# EAGLE design zOUT_v.1.0 (EAGLE 6.5.0)
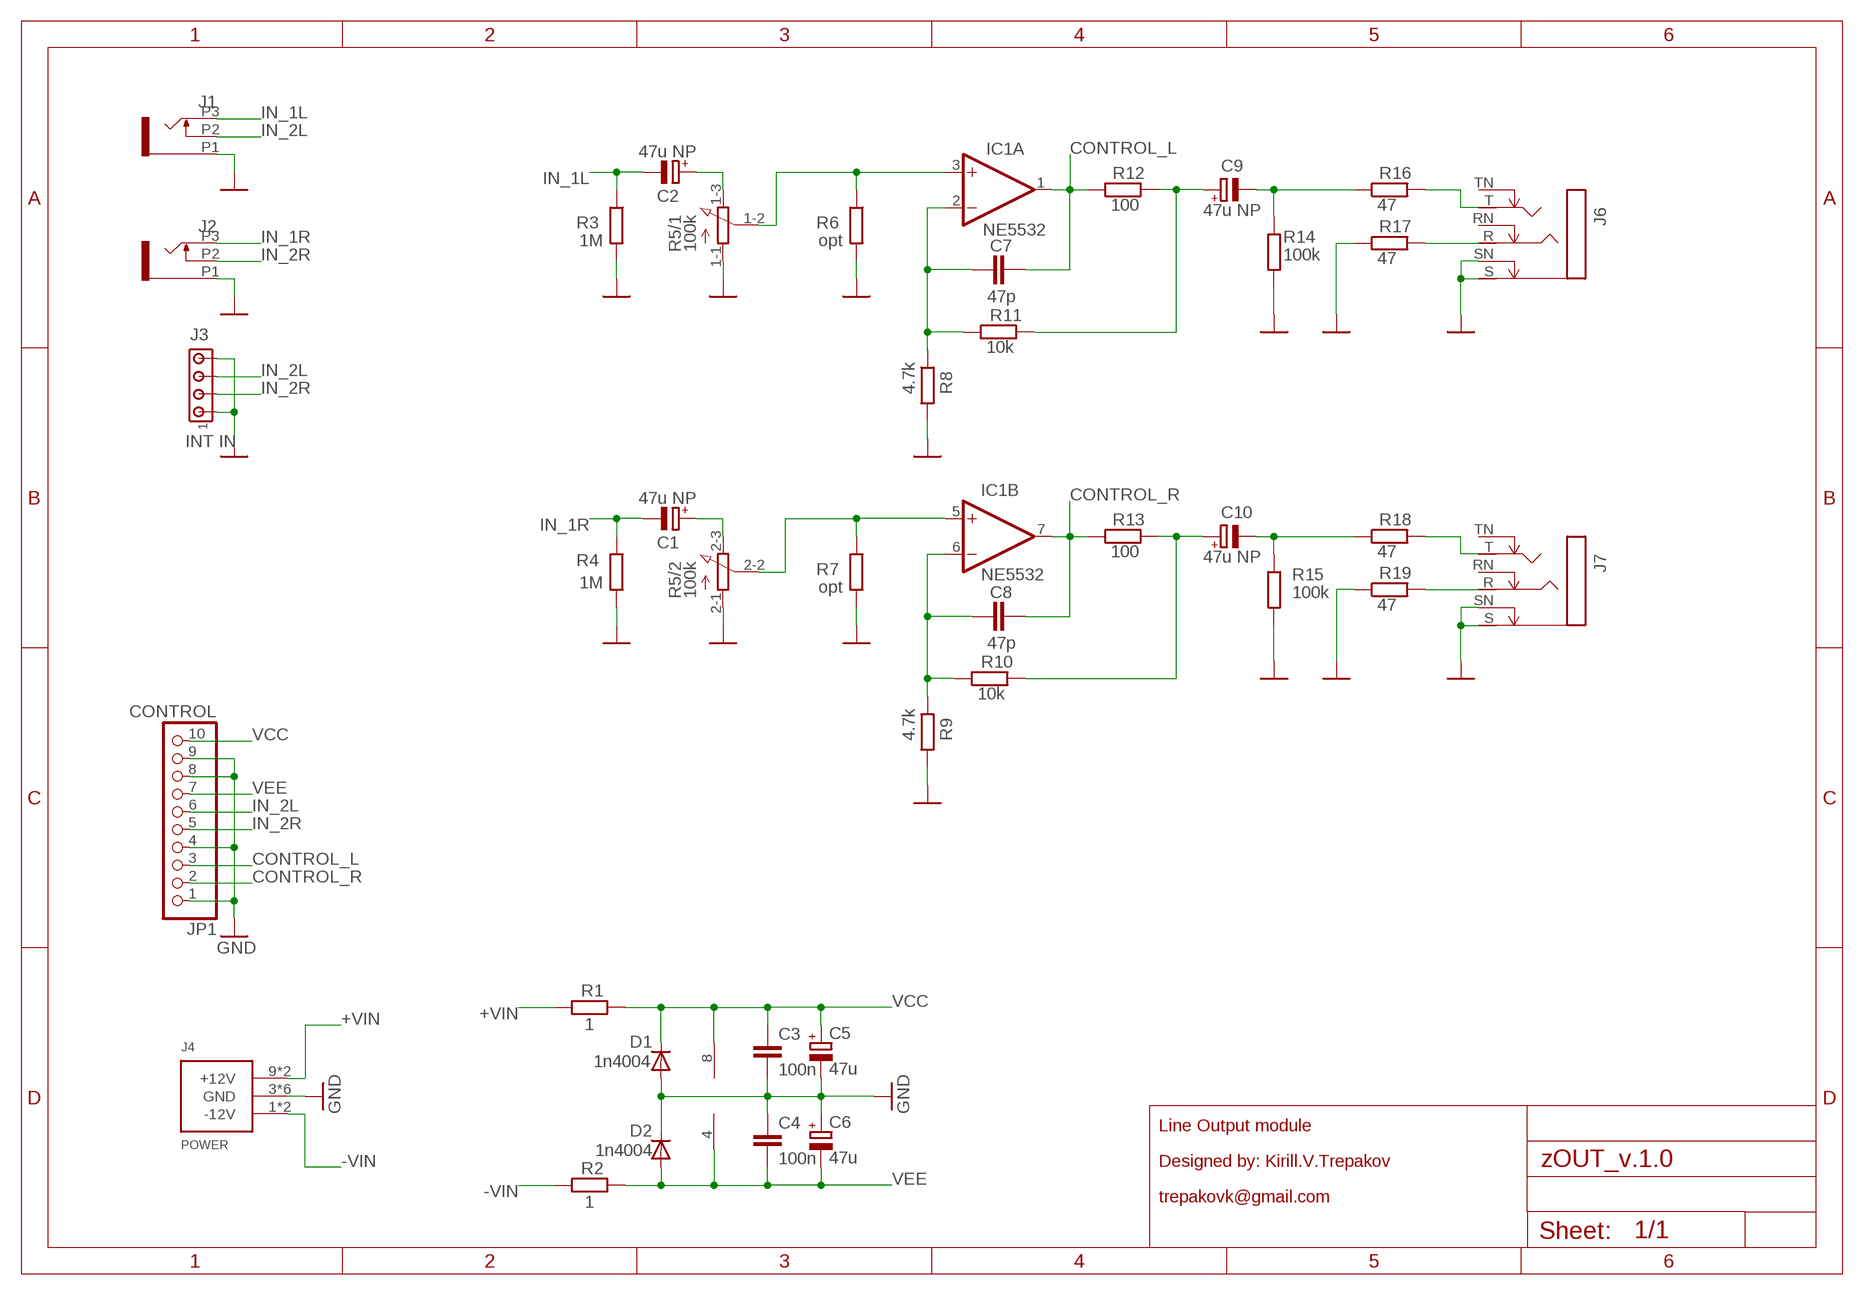
[diagram p0: schematic, sheet 1]

## Parts
C1  47u NP  CPOL-EUE2.5-6  [E2,5-6]
C2  47u NP  CPOL-EUE2.5-6  [E2,5-6]
C3  100n  C-EU050-024X044  [C050-024X044]
C4  100n  C-EU050-024X044  [C050-024X044]
C5  47u  CPOL-EUE2.5-5  [E2,5-5]
C6  47u  CPOL-EUE2.5-5  [E2,5-5]
C7  47p  C-EU050-024X044  [C050-024X044]
C8  47p  C-EU050-024X044  [C050-024X044]
C9  47u NP  CPOL-EUE2.5-6  [E2,5-6]
C10  47u NP  CPOL-EUE2.5-6  [E2,5-6]
D1  1n4004  1N4004"  [DO41-7.6]
D2  1n4004  1N4004"  [DO41-7.6]
IC1  NE5532  TL072P  [DIL08]
J1  IN L  WQP-PJ302M_JACK  [WQP-PJ302M_JACK]
J2  IN R  WQP-PJ302M_JACK  [WQP-PJ302M_JACK]
J3  INT IN  MTA04-100  [10X04MTA]
J4  POWER  POWER_SIMPLE10  [POWER_10]
J6  OUT L  STEREOSW1  [NMJ6HC-S]
J7  OUT R  STEREOSW1  [NMJ6HC-S]
JP1  CONTROL  PINHD-1X10  [1X10]
R1  1  R-EU_0204/7  [0204/7]
R2  1  R-EU_0204/7  [0204/7]
R3  1M  R-EU_0204/7  [0204/7]
R4  1M  R-EU_0204/7  [0204/7]
R5  100k  3RP/1610G  [3RP/1610G]
R6  opt  R-EU_0204/7  [0204/7]
R7  opt  R-EU_0204/7  [0204/7]
R8  4.7k  R-EU_0204/7  [0204/7]
R9  4.7k  R-EU_0204/7  [0204/7]
R10  10k  R-EU_0204/7  [0204/7]
R11  10k  R-EU_0204/7  [0204/7]
R12  100  R-EU_0204/7  [0204/7]
R13  100  R-EU_0204/7  [0204/7]
R14  100k  R-EU_0204/7  [0204/7]
R15  100k  R-EU_0204/7  [0204/7]
R16  47  R-EU_0204/7  [0204/7]
R17  47  R-EU_0204/7  [0204/7]
R18  47  R-EU_0204/7  [0204/7]
R19  47  R-EU_0204/7  [0204/7]

## Nets
+VIN: J4.9(+12V) J4.10(+12V) R1.1
-VIN: J4.1(-12V) J4.2(-12V) R2.1
CONTROL_L: C7.2 IC1.1(A:OUT) JP1.3 R12.1
CONTROL_R: C8.2 IC1.7(B:OUT) JP1.2 R13.1
GND: C3.2 C4.1 C5.- C6.+ D1.A D2.C J1.P1 J2.P1 J3.1 J3.4 J4.3(GND) J4.4(GND) J4.5(GND) J4.6(GND) J4.7(GND) J4.8(GND) J6.S J6.SN J7.S J7.SN JP1.1 JP1.4 JP1.8 JP1.9 R3.2 R4.2 R5.1-1(/1:A) R5.2-1(/2:A) R6.2 R7.2 R8.2 R9.2 R14.2 R15.2 R17.1 R19.1
IN_1L: C2.- J1.P3 R3.1
IN_1R: C1.- J2.P3 R4.1
IN_2L: J1.P2 J3.3 JP1.6
IN_2R: J2.P2 J3.2 JP1.5
N$1: C10.+ R10.2 R13.2
N$2: J6.R R17.2
N$5: C9.+ R11.2 R12.2
N$6: J7.R R19.2
N$9: J6.T R16.2
N$10: C1.+ R5.2-3(/2:E)
N$11: J7.T R18.2
N$12: C9.- R14.1 R16.1
N$13: C8.1 IC1.6(B:-IN) R9.1 R10.1
N$14: C2.+ R5.1-3(/1:E)
N$16: IC1.3(A:+IN) R5.1-2(/1:S) R6.1
N$17: IC1.5(B:+IN) R5.2-2(/2:S) R7.1
N$18: C10.- R15.1 R18.1
VCC: C3.1 C5.+ D1.C IC1.8(P:V+) JP1.10 R1.2
VEE: C4.2 C6.- D2.A IC1.4(P:V-) JP1.7 R2.2
VGND_L: C7.1 IC1.2(A:-IN) R8.1 R11.1
Unconnected: J6.RN J6.TN J7.RN J7.TN

## Notes on the sheet
- Line Output module
- Designed by: Kirill.V.Trepakov
- trepakovk@gmail.com

## Library data of the parts
C1 C2 C5 C6 C9 C10 = rcl:CPOL-EU: POLARIZED CAPACITOR, European symbol
C3 C4 C7 C8 = rcl:C-EU: CAPACITOR, European symbol
D1 D2 = _motovilo:1N4004: DIODE general purpose rectifier, 1 A
IC1 = kvitekp:TL072: OP AMP
J1 J2 = _motovilo:WQP-PJ302M_JACK
J3 = con-amp:MTA04-100: AMP connector
J4 = _motovilo:POWER_SIMPLE
J6 J7 = _motovilo:STEREOSW
JP1 = pinhead:PINHD-1X10: PIN HEADER
R1-R4 R6-R19 = rcl:R-EU_: RESISTOR, European symbol
R5 = _motovilo:3RP/1610G: 16mm Potentiometer two level Source: http://www.alphapotentiometers.net/html/16mm_pot_2.html

## Board
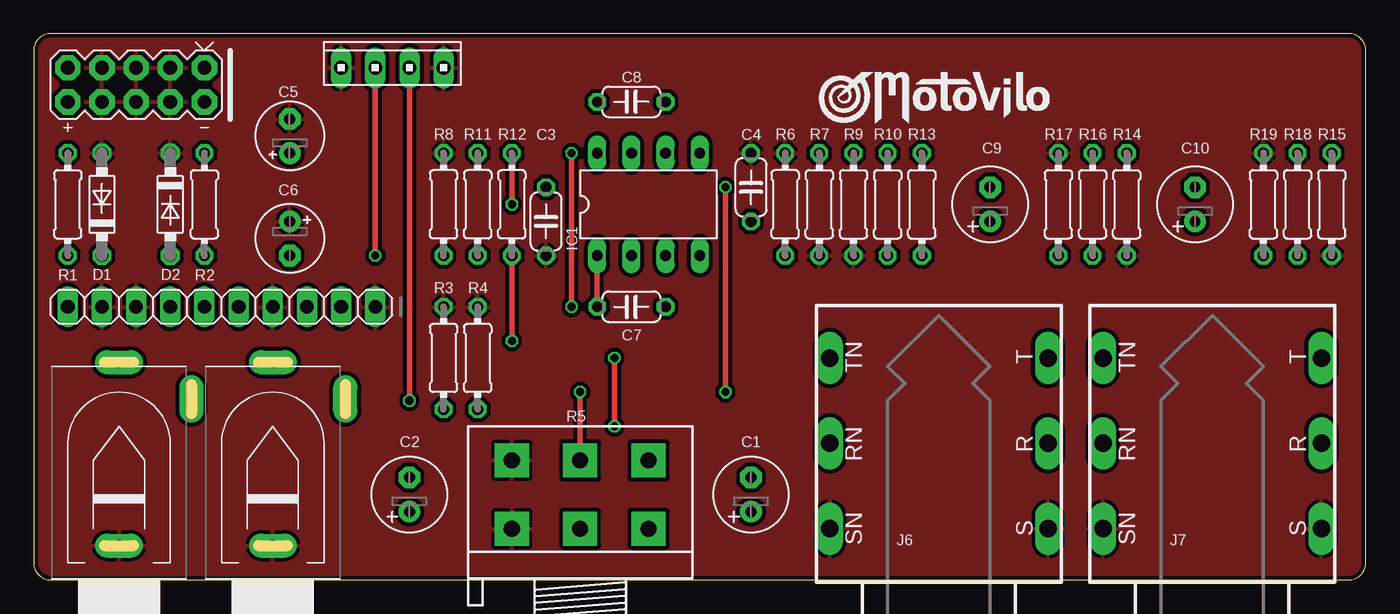
[diagram p1: board, top side]
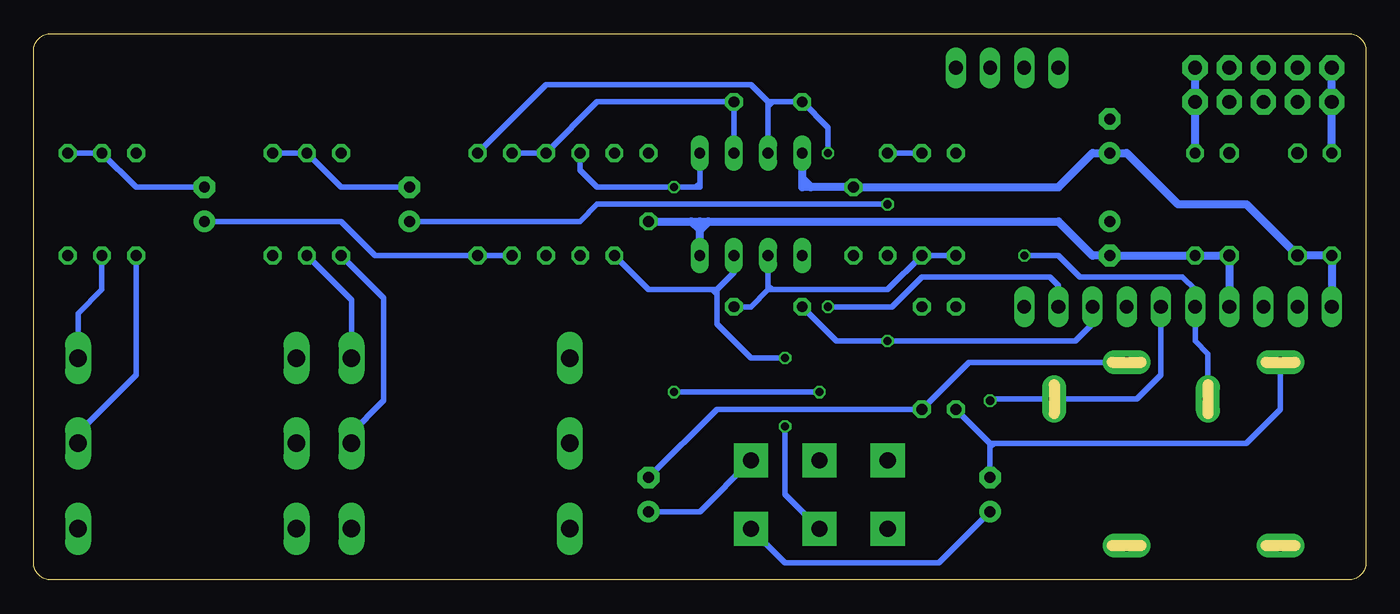
[diagram p2: board, bottom side, seen from below]

Size 99.06 x 40.64 mm. Coordinates in mm from the lower left corner, seen from the top.
Outline: 99.06,1.27 99.06,39.37 arc90 97.79,40.64 1.27,40.64 arc90 0,39.37 0,1.27 arc90 1.27,0 97.79,0 arc90 99.06,1.27
Copper layers (1*16): Top 0.035mm / dielectric 1.5mm / Bottom 0.035mm
Design rules "ITEADstudio_DRC_z *": minimum track width 6mil, minimum drill 12mil, track to track 10mil, track to pad 10mil, pad to pad 10mil, via to via 10mil, smd to smd 0mil, copper to edge 10mil, drill to drill 10mil, minimum pad ring 10mil, minimum via ring 6mil, stop-mask expansion 2mil, vias tented up to drill 100mil, thermal gap 10mil

### Footprints (pad centres in the part's own frame; a part is rotated, then mirrored left to right if it is on the bottom)
E2,5-6 = drill 0.813 pad 1.6: + -1.27,0 | drill 0.813 pad 1.6 octagon: - 1.27,0
C050-024X044 = drill 0.813 octagon: 1 -2.54,0; 2 2.54,0
E2,5-5 = drill 0.813 pad 1.6: + -1.27,0 | drill 0.813 pad 1.6 octagon: - 1.27,0
DO41-7.6 = drill 0.9 octagon: A 3.81,0; C -3.81,0
DIL08 = drill 0.813 long: 1 -3.81,-3.81; 2 -1.27,-3.81; 3 1.27,-3.81; 4 3.81,-3.81; 5 3.81,3.81; 6 1.27,3.81; 7 -1.27,3.81; 8 -3.81,3.81
WQP-PJ302M_JACK = drill 0.813 pad 1.778 long: P1 0,-5.08; P2 5.397,5.842; P3 0,8.572
10X04MTA = drill 1.016 long: 1 3.81,0; 2 1.27,0; 3 -1.27,0; 4 -3.81,0
POWER_10 = drill 1.016 pad 1.88 octagon: 1 1.27,-5.08; 2 -1.27,-5.08; 3 1.27,-2.54; 4 -1.27,-2.54; 5 1.27,0; 6 -1.27,0; 7 1.27,2.54; 8 -1.27,2.54; 9 1.27,5.08; 10 -1.27,5.08
NMJ6HC-S = drill 1.3 long: R 0,8.115; RN 0,-8.115; S 6.35,8.115; SN 6.35,-8.115; T -6.35,8.115; TN -6.35,-8.115
1X10 = drill 1.016 long: 1 -11.43,0; 2 -8.89,0; 3 -6.35,0; 4 -3.81,0; 5 -1.27,0; 6 1.27,0; 7 3.81,0; 8 6.35,0; 9 8.89,0; 10 11.43,0
0204/7 = drill 0.813 octagon: 1 -3.81,0; 2 3.81,0
3RP/1610G = drill 1.2 pad 2.54 square: 1-1 -5.08,0; 1-2 0,0; 1-3 5.08,0; 2-1 -5.08,5.08; 2-2 0,5.08; 2-3 5.08,5.08

### Placement (x,y rotation side)
C1  53.34,6.35 90 top
C2  27.94,6.35 90 top
C3  38.1,26.67 270 top
C4  53.34,29.21 270 top
C5  19.05,33.02 90 top
C6  19.05,25.4 270 top
C7  44.45,20.32 180 top
C8  44.45,35.56 180 top
C9  71.12,27.94 90 top
C10  86.36,27.94 90 top
D1  5.08,27.94 90 top
D2  10.16,27.94 270 top
IC1  45.72,27.94 0 top
J1  6.35,7.62 0 top
J2  17.78,7.62 0 top
J3  26.67,38.1 0 top
J4  7.62,36.83 90 top
J6  67.31,10.16 270 top
J7  87.63,10.16 270 top
JP1  13.97,20.32 180 top
R1  2.54,27.94 270 top
R2  12.7,27.94 270 top
R3  30.48,16.51 90 top
R4  33.02,16.51 90 top
R5  40.64,3.81 0 top
R6  55.88,27.94 90 top
R7  58.42,27.94 270 top
R8  30.48,27.94 90 top
R9  60.96,27.94 270 top
R10  63.5,27.94 270 top
R11  33.02,27.94 90 top
R12  35.56,27.94 90 top
R13  66.04,27.94 270 top
R14  81.28,27.94 270 top
R15  96.52,27.94 270 top
R16  78.74,27.94 270 top
R17  76.2,27.94 270 top
R18  93.98,27.94 270 top
R19  91.44,27.94 270 top
U$2  [LOGO_SPACE_002]  58.42,33.97 0 top

### Tracks (layer width: path | path; a pad name or v marks a point on that pad's centre or on a via)
+VIN
  Bottom 0.61: R1.1 J4.10 J4.9
-VIN
  Bottom 0.61: R2.1 J4.2 J4.1
CONTROL_L  (via drill 0.6)
  Top 0.406: R12.1 v35.56,17.78 | IC1.1 C7.2
  Bottom 0.406: JP1.3 20.32,19.05 21.59,17.78 v35.56,17.78 39.37,17.78 C7.2
CONTROL_R  (via drill 0.6)
  Top 0.406: v40.01,31.75 v40.01,20.32
  Bottom 0.406: 44.45,35.56 45.72,36.83 60.96,36.83 R13.1 | 44.45,35.56 44.13,35.56 | 44.13,35.56 C8.2 40.01,33.66 v40.01,31.75 | IC1.7 44.45,35.24 | 44.45,35.24 44.45,35.56 | 44.13,35.56 44.45,35.24 | v40.01,20.32 35.24,20.32 33.02,22.54 23.5,22.54 22.86,21.91 JP1.2
GND
  pour Top (isolate 0.305): 0,40.64 99.06,40.64 99.06,0 0,0
IN_1L
  Bottom 0.406: J1.P3 6.35,12.7 8.89,10.16 27.62,10.16 | 27.62,10.16 27.94,10.16 | 27.94,10.16 R3.1 | C2.- 27.94,9.84 | 27.94,9.84 27.94,10.16 | 27.62,10.16 27.94,9.84
IN_1R
  Bottom 0.406: J2.P3 29.53,16.19 R4.1 48.26,12.7 C1.-
IN_2L  (via drill 0.6)
  Top 0.406: v25.4,24.13 J3.3
  Bottom 0.406: J1.P2 11.75,16.83 12.7,17.78 JP1.6 12.7,21.59 13.65,22.54 21.27,22.54 22.86,24.13 v25.4,24.13
IN_2R  (via drill 0.6)
  Top 0.406: v27.94,13.34 J3.2
  Bottom 0.406: v27.94,13.34 27.81,13.46 J2.P2 17.02,13.46 15.24,15.24 JP1.5
N$1
  Bottom 0.406: R10.2 R13.2 73.66,24.13 76.2,26.67 C10.+
N$2
  Bottom 0.406: R17.2 73.03,20.95 73.03,13.34 75.56,10.79 75.56,10.3 J6.R
N$5  (via drill 0.6)
  Top 0.406: v35.56,27.94 R12.2
  Bottom 0.406: R11.2 R12.2 | v35.56,27.94 57.15,27.94 58.42,26.67 C9.+
N$6
  Bottom 0.406: J7.R 95.75,10.94 91.44,15.24 R19.2
N$9
  Bottom 0.406: J6.T 75.42,20.82 R16.2
N$10
  Bottom 0.406: R5.2-3 49.53,5.08 C1.+
N$11
  Bottom 0.406: J7.T 95.75,19.82 93.98,21.59 R18.2
N$12
  Bottom 0.406: R14.1 R16.1 76.2,29.21 C9.-
N$13
  Bottom 0.406: R10.1 R9.1 57.15,35.56 C8.1 IC1.6
N$14
  Bottom 0.406: R5.1-3 43.18,1.27 31.75,1.27 C2.+
N$16  (via drill 0.6)
  Top 0.406: v43.18,11.43 v43.18,16.51
  Bottom 0.406: R5.1-2 43.18,6.35 v43.18,11.43 | 48.26,21.59 46.99,22.86 IC1.3 | v43.18,16.51 45.72,16.51 48.26,19.05 48.26,21.27 | 48.26,21.27 48.26,21.59 | R6.1 53.34,21.59 48.58,21.59 | 48.58,21.59 48.26,21.59 | 48.58,21.59 48.26,21.27
N$17  (via drill 0.6)
  Top 0.406: v51.44,29.21 v51.44,13.97 | v40.64,13.97 R5.2-2
  Bottom 0.406: v51.44,13.97 v40.64,13.97 | 49.85,29.21 v51.44,29.21 57.15,29.21 58.42,30.48 R7.1 | 49.85,29.21 49.53,29.21 49.53,29.53 | IC1.5 49.53,29.53 | 49.53,29.53 49.85,29.21
N$18
  Bottom 0.406: C10.- 91.44,29.21 R18.1 R15.1
VCC
  Bottom 0.61: JP1.10 R1.2 D1.C 8.89,27.94 13.97,27.94 17.78,31.75 C5.+ 20.32,31.75 22.86,29.21 C3.1 41.27,29.21 | 41.27,29.21 41.91,29.21 41.91,29.84 | 41.91,29.84 IC1.8 | 41.27,29.21 41.91,29.84
VEE
  Bottom 0.406: 49.53,26.04 49.53,26.67
  Bottom 0.61: JP1.7 D2.A R2.2 C6.- 20.32,24.13 22.86,26.67 48.9,26.67 | C4.2 50.16,26.67 | 50.16,26.67 49.53,26.67 48.9,26.67 | IC1.4 49.53,26.04 | 49.53,26.04 48.9,26.67 | 49.53,26.04 50.16,26.67
VGND_L
  Bottom 0.406: R8.1 R11.1 35.56,21.59 44.13,21.59 | 44.45,21.59 44.13,21.59 | IC1.2 44.45,21.91 | 44.45,21.91 44.45,21.59 | C7.1 45.72,20.32 44.45,21.59 | 44.45,21.91 44.13,21.59

### Text on the board
tDocu: zOUT v.1.0